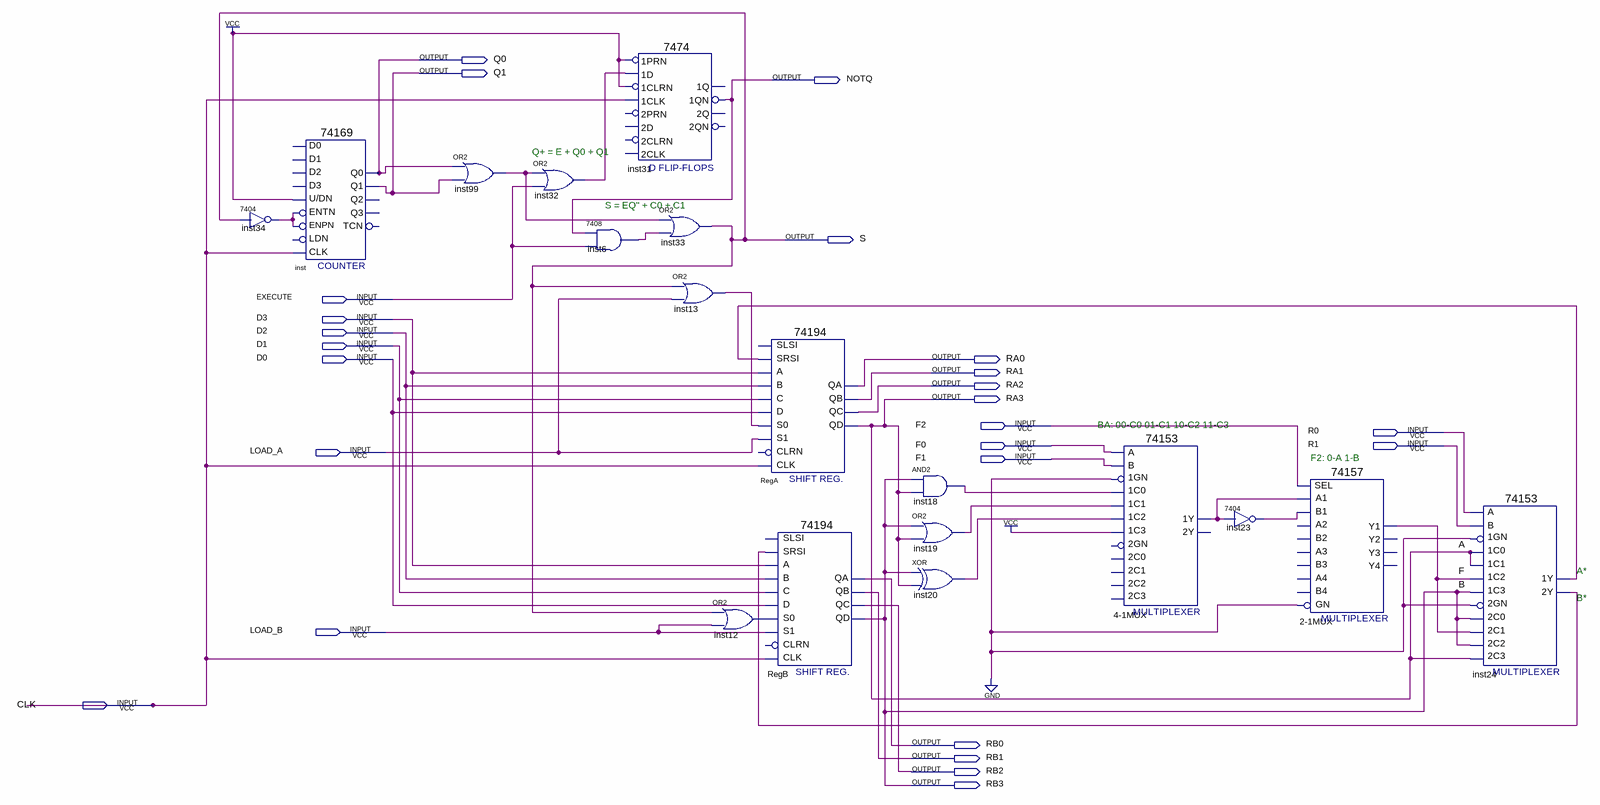
[diagram p0: schematic sheet]
// Quartus schematic lab3.bdf as structural Verilog: 18 symbols, 25 pins
module lab3 (
  input  EXECUTE,
  input  D3,
  input  D2,
  input  D1,
  input  D0,
  input  F2,
  input  R0,
  input  F0,
  input  R1,
  input  LOAD_A,
  input  F1,
  input  LOAD_B,
  input  CLK,
  output Q0,
  output Q1,
  output NOTQ,
  output S,
  output RA0,
  output RA1,
  output RA2,
  output RA3,
  output RB0,
  output RB1,
  output RB2,
  output RB3
);

  wire F, inst6_1, inst12_out, inst13_out, inst18_out, inst19_out, inst20_out, inst23_1, inst24_1y,
       inst24_2y, inst32_out, inst34_1, inst99_out, n4_1MUX_1y;

  \7404  inst34 (.\2 (S), .\1 (inst34_1));
  \74169  inst (
    .ENTN(inst34_1), .\U/DN (1'b1), .CLK(CLK), .ENPN(inst34_1), .Q1(Q1), .Q0(Q0));  // open: D1, D2, D0, D3, LDN, Q2, TCN, Q3
  or inst99 (inst99_out, Q0, Q1);
  or inst32 (inst32_out, inst99_out, EXECUTE);
  \7474  inst31 (
    .\1CLK (CLK), .\1D (inst32_out), .\1PRN (1'b1), .\1CLRN (1'b1), .\1QN (NOTQ));  // open: 2D, 2PRN, 2CLK, 2CLRN, 2Q, 2QN, 1Q
  \7408  inst6 (.\3 (EXECUTE), .\2 (NOTQ), .\1 (inst6_1));
  or inst33 (S, inst99_out, inst6_1);
  or inst13 (inst13_out, S, LOAD_A);
  or inst12 (inst12_out, S, LOAD_B);
  \74194  RegA (
    .SRSI(inst24_1y), .B(D2), .C(D1), .CLK(CLK), .D(D0), .S1(LOAD_A), .S0(inst13_out), .A(D3), .QA(RA0),
    .QB(RA1), .QC(RA2), .QD(RA3));  // open: SLSI, CLRN
  \74194  RegB (
    .SRSI(inst24_2y), .B(D2), .C(D1), .CLK(CLK), .D(D0), .S1(LOAD_B), .S0(inst12_out), .A(D3), .QA(RB0),
    .QB(RB1), .QC(RB2), .QD(RB3));  // open: SLSI, CLRN
  and inst18 (inst18_out, RB3, RA3);
  or inst19 (inst19_out, RB3, RA3);
  xor inst20 (inst20_out, RB3, RA3);
  \74153  \u_4-1MUX  (
    .\1C1 (inst19_out), .\1GN (1'b0), .\1C0 (inst18_out), .\1C2 (inst20_out), .\1C3 (1'b1), .B(F1), .A(F0),
    .\1Y (n4_1MUX_1y));  // open: 2C0, 2GN, 2C2, 2C1, 2C3, 2Y
  \7404  inst23 (.\2 (n4_1MUX_1y), .\1 (inst23_1));
  \74157  \u_2-1MUX  (
    .A1(n4_1MUX_1y), .B1(inst23_1), .SEL(F2), .GN(1'b0), .Y1(F));  // open: B2, A3, B3, A2, B4, A4, Y2, Y4, Y3
  \74153  inst24 (
    .\1C1 (RA3), .\1GN (1'b0), .\1C0 (RA3), .\2C0 (RB3), .\2GN (1'b0), .\2C2 (RB3), .\1C2 (F), .\1C3 (RB3),
    .B(R1), .A(R0), .\2C1 (F), .\2C3 (RA3), .\1Y (inst24_1y), .\2Y (inst24_2y));

  // Other names for the same wires on the sheet: A = RA3; B = RB3

  // Notes on the sheet:
  //   Q+ = E + Q0 + Q1
  //   S = EQ" + C0 + C1
  //   BA: 00-C0 01-C1 10-C2 11-C3
  //   F2: 0-A 1-B
  //   A*
  //   B*
endmodule
